# EAGLE schematic base (EAGLE 7.7.0)

## Sheet 1 of 2
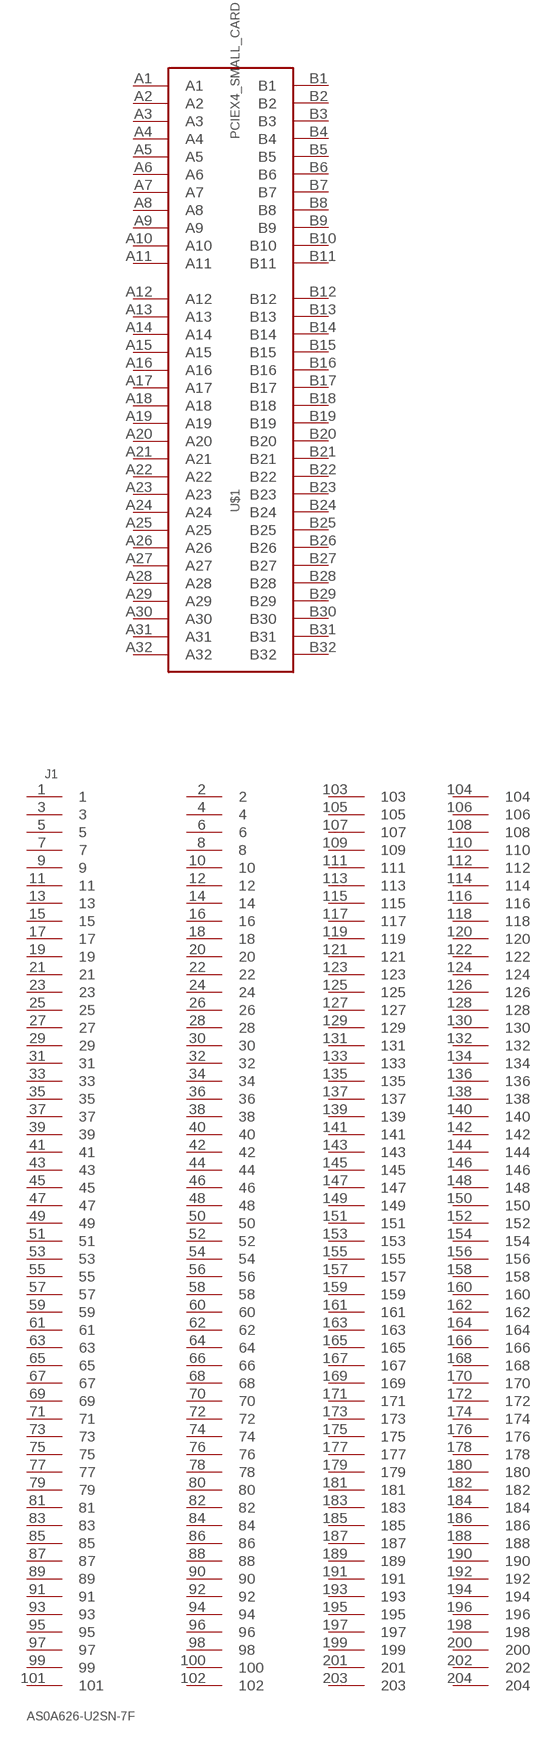
[diagram p0: schematic, sheet 1]

### Parts
J1  AS0A626-U2SN-7F  [FOXCONN_AS0A626-U2SN-7F]
U$1  PCIEX4_SMALL_CARD  [PCIEX4_SMALL_CARD]
Unconnected: J1.1 J1.2 J1.3 J1.4 J1.5 J1.6 J1.7 J1.8 J1.9 J1.10 J1.11 J1.12 J1.13 J1.14 J1.15 J1.16 J1.17 J1.18 J1.19 J1.20 J1.21 J1.22 J1.23 J1.24 J1.25 J1.26 J1.27 J1.28 J1.29 J1.30 J1.31 J1.32 J1.33 J1.34 J1.35 J1.36 J1.37 J1.38 J1.39 J1.40 J1.41 J1.42 J1.43 J1.44 J1.45 J1.46 J1.47 J1.48 J1.49 J1.50 J1.51 J1.52 J1.53 J1.54 J1.55 J1.56 J1.57 J1.58 J1.59 J1.60 J1.61 J1.62 J1.63 J1.64 J1.65 J1.66 J1.67 J1.68 J1.69 J1.70 J1.71 J1.72 J1.73 J1.74 J1.75 J1.76 J1.77 J1.78 J1.79 J1.80 J1.81 J1.82 J1.83 J1.84 J1.85 J1.86 J1.87 J1.88 J1.89 J1.90 J1.91 J1.92 J1.93 J1.94 J1.95 J1.96 J1.97 J1.98 J1.99 J1.100 J1.101 J1.102 J1.103 J1.104 J1.105 J1.106 J1.107 J1.108 J1.109 J1.110 J1.111 J1.112 J1.113 J1.114 J1.115 J1.116 J1.117 J1.118 J1.119 J1.120 J1.121 J1.122 J1.123 J1.124 J1.125 J1.126 J1.127 J1.128 J1.129 J1.130 J1.131 J1.132 J1.133 J1.134 J1.135 J1.136 J1.137 J1.138 J1.139 J1.140 J1.141 J1.142 J1.143 J1.144 J1.145 J1.146 J1.147 J1.148 J1.149 J1.150 J1.151 J1.152 J1.153 J1.154 J1.155 J1.156 J1.157 J1.158 J1.159 J1.160 J1.161 J1.162 J1.163 J1.164 J1.165 J1.166 J1.167 J1.168 J1.169 J1.170 J1.171 J1.172 J1.173 J1.174 J1.175 J1.176 J1.177 J1.178 J1.179 J1.180 J1.181 J1.182 J1.183 J1.184 J1.185 J1.186 J1.187 J1.188 J1.189 J1.190 J1.191 J1.192 J1.193 J1.194 J1.195 J1.196 J1.197 J1.198 J1.199 J1.200 J1.201 J1.202 J1.203 J1.204 U$1.A1 U$1.A2 U$1.A3 U$1.A4 U$1.A5 U$1.A6 U$1.A7 U$1.A8 U$1.A9 U$1.A10 U$1.A11 U$1.A12 U$1.A13 U$1.A14 U$1.A15 U$1.A16 U$1.A17 U$1.A18 U$1.A19 U$1.A20 U$1.A21 U$1.A22 U$1.A23 U$1.A24 U$1.A25 U$1.A26 U$1.A27 U$1.A28 U$1.A29 U$1.A30 U$1.A31 U$1.A32 U$1.B1 U$1.B2 U$1.B3 U$1.B4 U$1.B5 U$1.B6 U$1.B7 U$1.B8 U$1.B9 U$1.B10 U$1.B11 U$1.B12 U$1.B13 U$1.B14 U$1.B15 U$1.B16 U$1.B17 U$1.B18 U$1.B19 U$1.B20 U$1.B21 U$1.B22 U$1.B23 U$1.B24 U$1.B25 U$1.B26 U$1.B27 U$1.B28 U$1.B29 U$1.B30 U$1.B31 U$1.B32

## Sheet 2 of 2
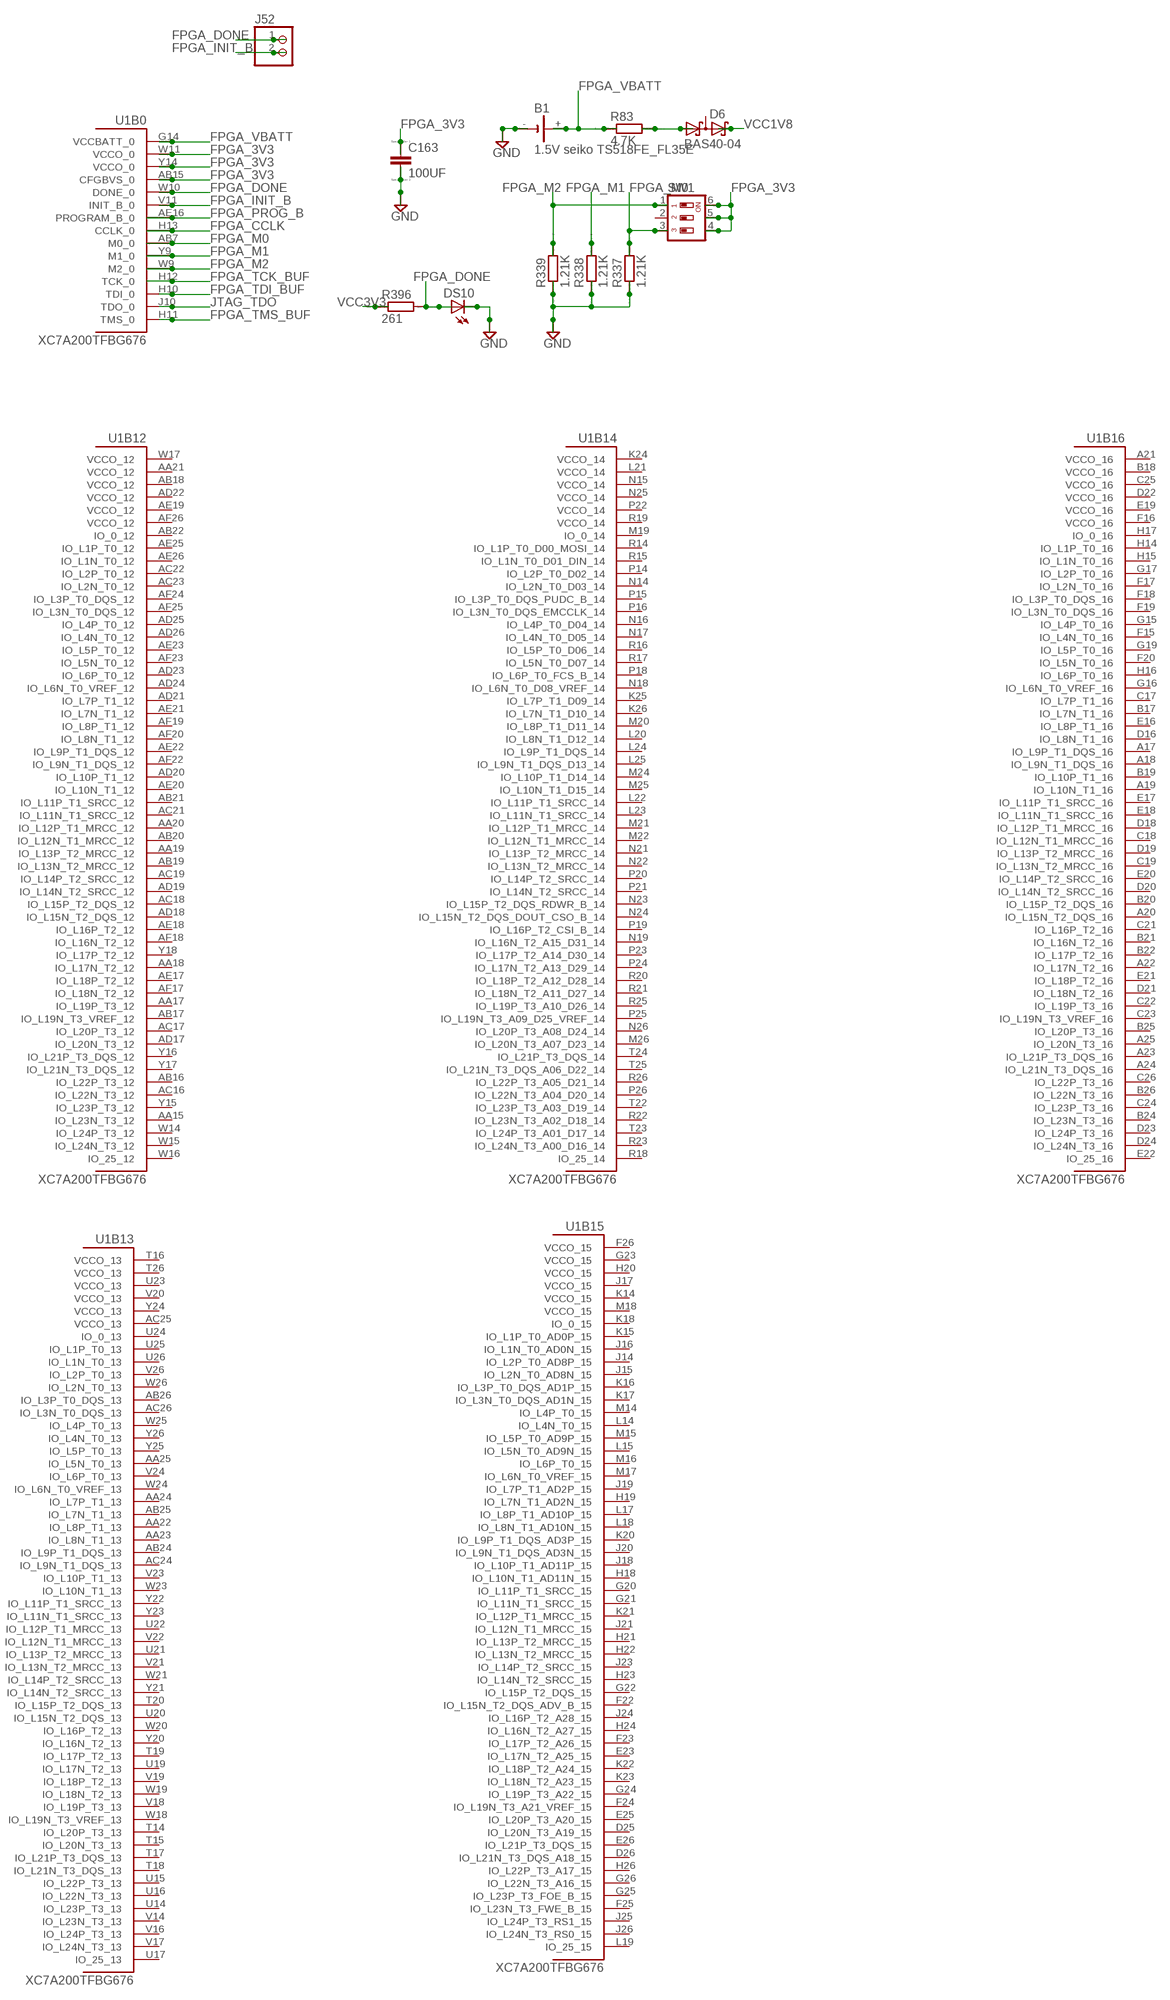
[diagram p1: schematic, sheet 2, part 1 of 3]
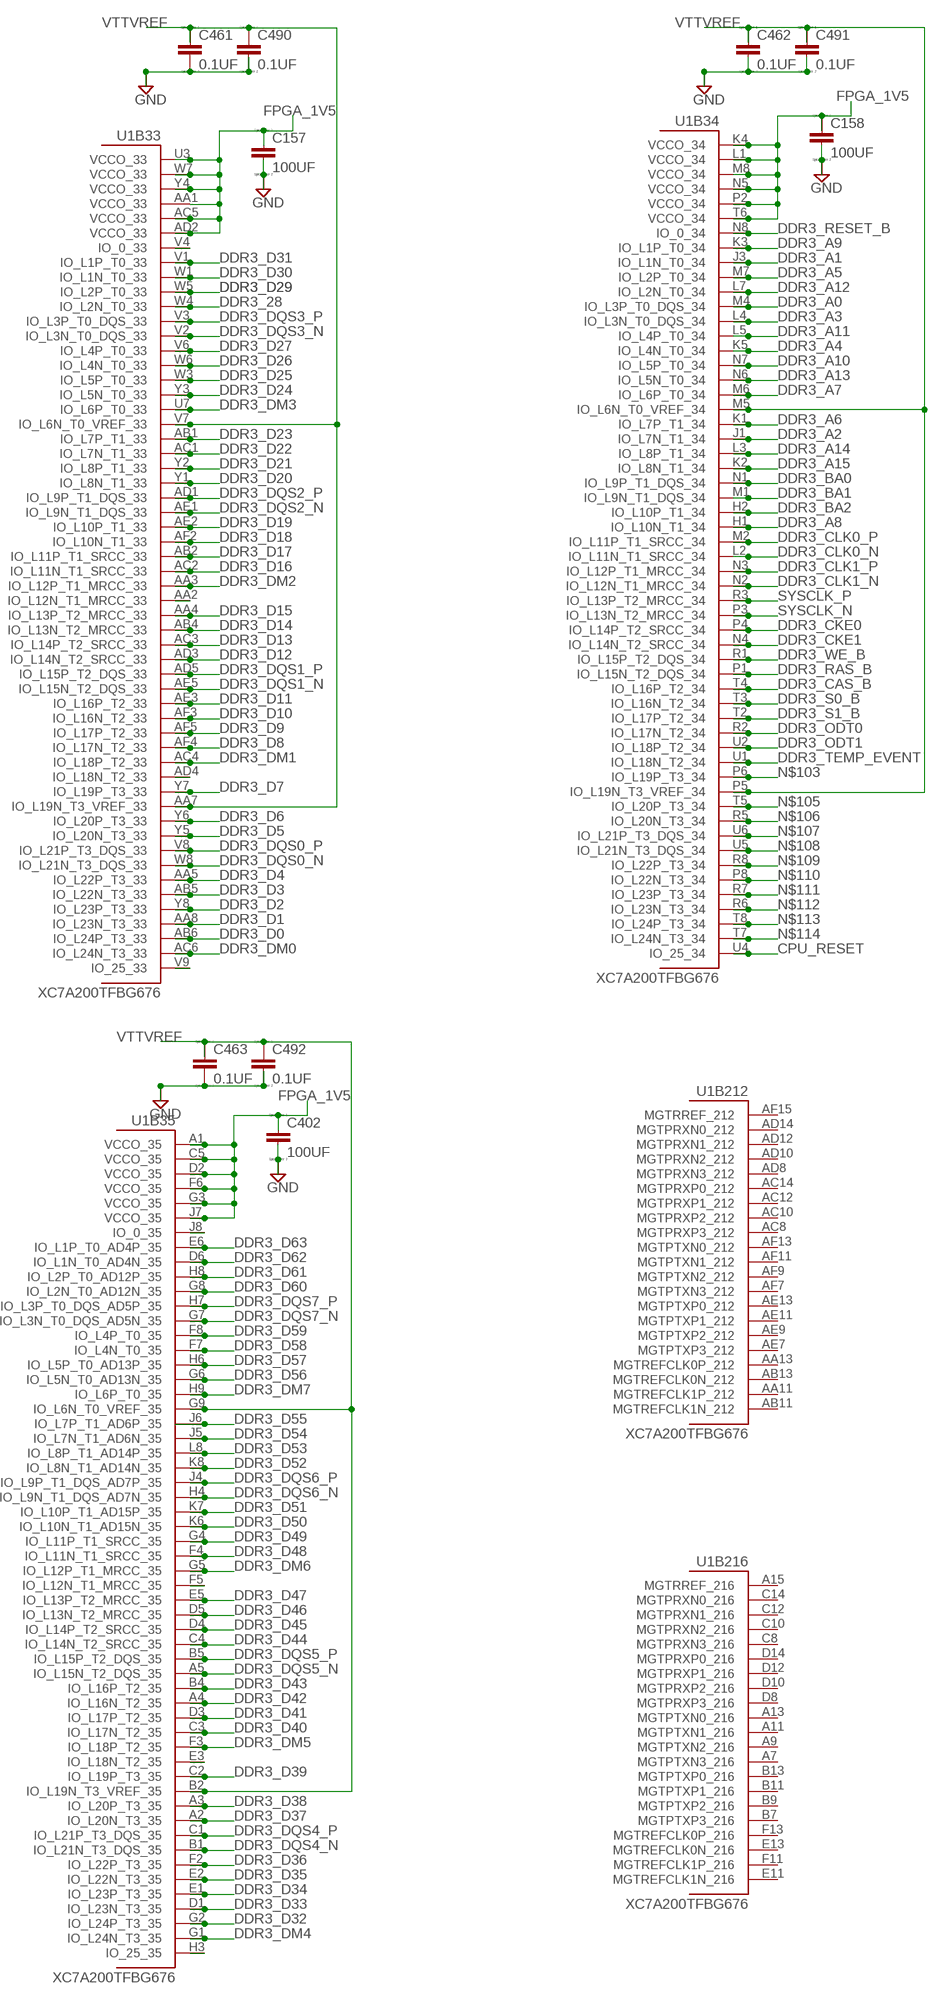
[diagram p2: schematic, sheet 2, part 2 of 3]
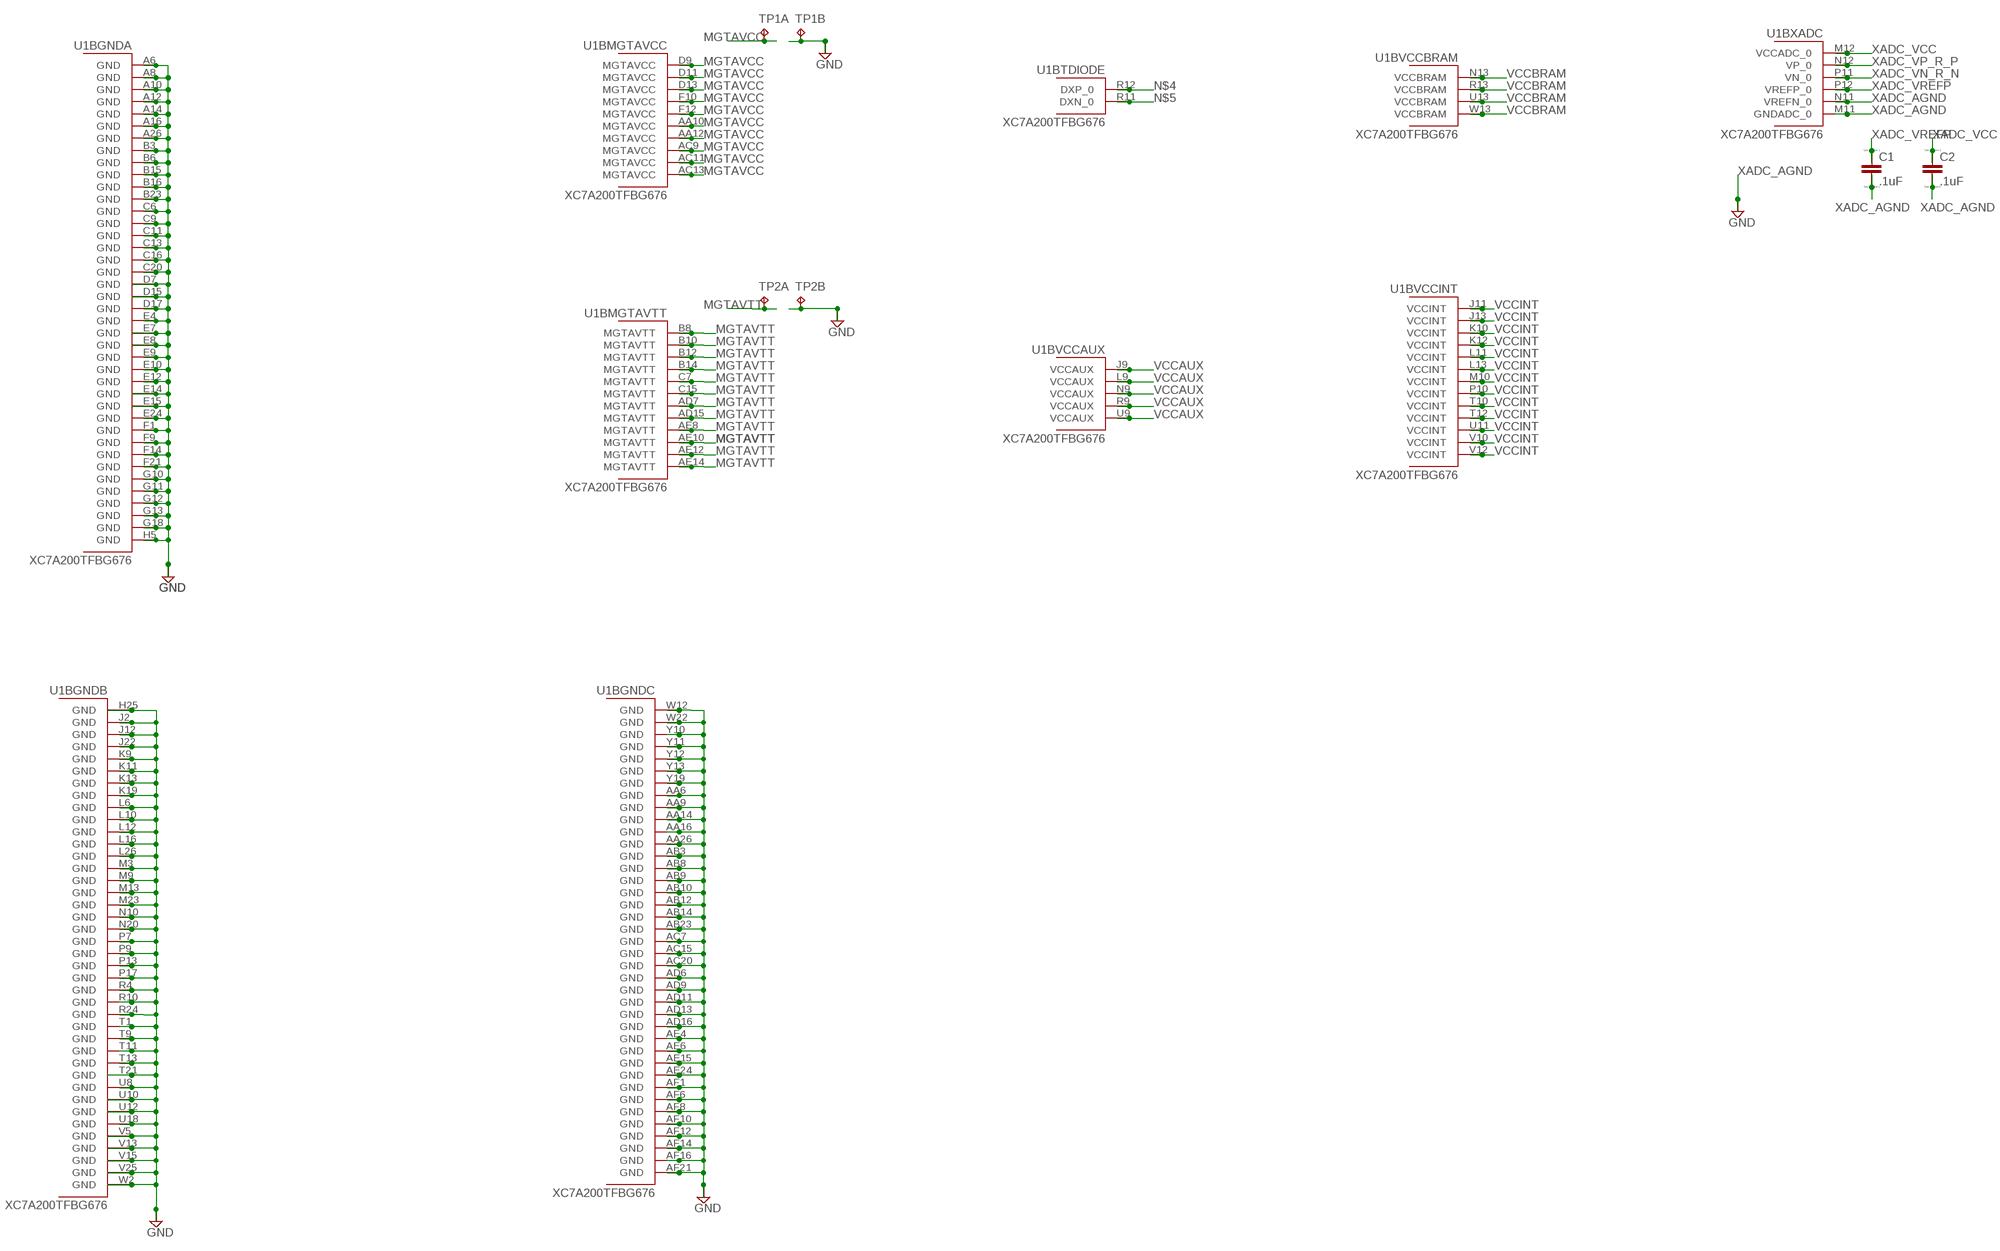
[diagram p3: schematic, sheet 2, part 3 of 3]

### Parts
B1  1.5V seiko TS518FE_FL35E  CH291-1220LF  [CH291-1220LF]
C1  .1uF  CC0402  [C0402]
C2  .1uF  CC0402  [C0402]
C157  100UF  CC1206  [C1206]
C158  100UF  CC1206  [C1206]
C163  100UF  CC1206  [C1206]
C402  100UF  CC1206  [C1206]
C461  0.1UF  CC0402  [C0402]
C462  0.1UF  CC0402  [C0402]
C463  0.1UF  CC0402  [C0402]
C490  0.1UF  CC0402  [C0402]
C491  0.1UF  CC0402  [C0402]
C492  0.1UF  CC0402  [C0402]
D6  BAS40-04  [SOT23]
DS10  LEDCHIP-LED0603  [CHIP-LED0603]
J52  PINHD-1X2  [1X02]
R83  4.7K  RR0402  [R0402]
R337  1.21K  RR0402  [R0402]
R338  1.21K  RR0402  [R0402]
R339  1.21K  RR0402  [R0402]
R396  261  RR0402  [R0402]
SW1  SWS003  [SMS-003]
TP1  TP2P2-38-17  [P2-38-17]
TP2  TP2P2-38-17  [P2-38-17]
U1  XC7A200TFBG676  [FF676]

### Nets
CPU_RESET: U1.U4(B34:IO_25_34)
DDR3_28: U1.W4(B33:IO_L2N_T0_33)
DDR3_A0: U1.M4(B34:IO_L3P_T0_DQS_34)
DDR3_A1: U1.J3(B34:IO_L1N_T0_34)
DDR3_A2: U1.J1(B34:IO_L7N_T1_34)
DDR3_A3: U1.L4(B34:IO_L3N_T0_DQS_34)
DDR3_A4: U1.K5(B34:IO_L4N_T0_34)
DDR3_A5: U1.M7(B34:IO_L2P_T0_34)
DDR3_A6: U1.K1(B34:IO_L7P_T1_34)
DDR3_A7: U1.M6(B34:IO_L6P_T0_34)
DDR3_A8: U1.H1(B34:IO_L10N_T1_34)
DDR3_A9: U1.K3(B34:IO_L1P_T0_34)
DDR3_A10: U1.N7(B34:IO_L5P_T0_34)
DDR3_A11: U1.L5(B34:IO_L4P_T0_34)
DDR3_A12: U1.L7(B34:IO_L2N_T0_34)
DDR3_A13: U1.N6(B34:IO_L5N_T0_34)
DDR3_A14: U1.L3(B34:IO_L8P_T1_34)
DDR3_A15: U1.K2(B34:IO_L8N_T1_34)
DDR3_BA0: U1.N1(B34:IO_L9P_T1_DQS_34)
DDR3_BA1: U1.M1(B34:IO_L9N_T1_DQS_34)
DDR3_BA2: U1.H2(B34:IO_L10P_T1_34)
DDR3_CAS_B: U1.T4(B34:IO_L16P_T2_34)
DDR3_CKE0: U1.P4(B34:IO_L14P_T2_SRCC_34)
DDR3_CKE1: U1.N4(B34:IO_L14N_T2_SRCC_34)
DDR3_CLK0_N: U1.L2(B34:IO_L11N_T1_SRCC_34)
DDR3_CLK0_P: U1.M2(B34:IO_L11P_T1_SRCC_34)
DDR3_CLK1_N: U1.N2(B34:IO_L12N_T1_MRCC_34)
DDR3_CLK1_P: U1.N3(B34:IO_L12P_T1_MRCC_34)
DDR3_D0: U1.AB6(B33:IO_L24P_T3_33)
DDR3_D1: U1.AA8(B33:IO_L23N_T3_33)
DDR3_D2: U1.Y8(B33:IO_L23P_T3_33)
DDR3_D3: U1.AB5(B33:IO_L22N_T3_33)
DDR3_D4: U1.AA5(B33:IO_L22P_T3_33)
DDR3_D5: U1.Y5(B33:IO_L20N_T3_33)
DDR3_D6: U1.Y6(B33:IO_L20P_T3_33)
DDR3_D7: U1.Y7(B33:IO_L19P_T3_33)
DDR3_D8: U1.AF4(B33:IO_L17N_T2_33)
DDR3_D9: U1.AF5(B33:IO_L17P_T2_33)
DDR3_D10: U1.AF3(B33:IO_L16N_T2_33)
DDR3_D11: U1.AE3(B33:IO_L16P_T2_33)
DDR3_D12: U1.AD3(B33:IO_L14N_T2_SRCC_33)
DDR3_D13: U1.AC3(B33:IO_L14P_T2_SRCC_33)
DDR3_D14: U1.AB4(B33:IO_L13N_T2_MRCC_33)
DDR3_D15: U1.AA4(B33:IO_L13P_T2_MRCC_33)
DDR3_D16: U1.AC2(B33:IO_L11N_T1_SRCC_33)
DDR3_D17: U1.AB2(B33:IO_L11P_T1_SRCC_33)
DDR3_D18: U1.AF2(B33:IO_L10N_T1_33)
DDR3_D19: U1.AE2(B33:IO_L10P_T1_33)
DDR3_D20: U1.Y1(B33:IO_L8N_T1_33)
DDR3_D21: U1.Y2(B33:IO_L8P_T1_33)
DDR3_D22: U1.AC1(B33:IO_L7N_T1_33)
DDR3_D23: U1.AB1(B33:IO_L7P_T1_33)
DDR3_D24: U1.Y3(B33:IO_L5N_T0_33)
DDR3_D25: U1.W3(B33:IO_L5P_T0_33)
DDR3_D26: U1.W6(B33:IO_L4N_T0_33)
DDR3_D27: U1.V6(B33:IO_L4P_T0_33)
DDR3_D29: U1.W5(B33:IO_L2P_T0_33)
DDR3_D30: U1.W1(B33:IO_L1N_T0_33)
DDR3_D31: U1.V1(B33:IO_L1P_T0_33)
DDR3_D32: U1.G2(B35:IO_L24P_T3_35)
DDR3_D33: U1.D1(B35:IO_L23N_T3_35)
DDR3_D34: U1.E1(B35:IO_L23P_T3_35)
DDR3_D35: U1.E2(B35:IO_L22N_T3_35)
DDR3_D36: U1.F2(B35:IO_L22P_T3_35)
DDR3_D37: U1.A2(B35:IO_L20N_T3_35)
DDR3_D38: U1.A3(B35:IO_L20P_T3_35)
DDR3_D39: U1.C2(B35:IO_L19P_T3_35)
DDR3_D40: U1.C3(B35:IO_L17N_T2_35)
DDR3_D41: U1.D3(B35:IO_L17P_T2_35)
DDR3_D42: U1.A4(B35:IO_L16N_T2_35)
DDR3_D43: U1.B4(B35:IO_L16P_T2_35)
DDR3_D44: U1.C4(B35:IO_L14N_T2_SRCC_35)
DDR3_D45: U1.D4(B35:IO_L14P_T2_SRCC_35)
DDR3_D46: U1.D5(B35:IO_L13N_T2_MRCC_35)
DDR3_D47: U1.E5(B35:IO_L13P_T2_MRCC_35)
DDR3_D48: U1.F4(B35:IO_L11N_T1_SRCC_35)
DDR3_D49: U1.G4(B35:IO_L11P_T1_SRCC_35)
DDR3_D50: U1.K6(B35:IO_L10N_T1_AD15N_35)
DDR3_D51: U1.K7(B35:IO_L10P_T1_AD15P_35)
DDR3_D52: U1.K8(B35:IO_L8N_T1_AD14N_35)
DDR3_D53: U1.L8(B35:IO_L8P_T1_AD14P_35)
DDR3_D54: U1.J5(B35:IO_L7N_T1_AD6N_35)
DDR3_D55: U1.J6(B35:IO_L7P_T1_AD6P_35)
DDR3_D56: U1.G6(B35:IO_L5N_T0_AD13N_35)
DDR3_D57: U1.H6(B35:IO_L5P_T0_AD13P_35)
DDR3_D58: U1.F7(B35:IO_L4N_T0_35)
DDR3_D59: U1.F8(B35:IO_L4P_T0_35)
DDR3_D60: U1.G8(B35:IO_L2N_T0_AD12N_35)
DDR3_D61: U1.H8(B35:IO_L2P_T0_AD12P_35)
DDR3_D62: U1.D6(B35:IO_L1N_T0_AD4N_35)
DDR3_D63: U1.E6(B35:IO_L1P_T0_AD4P_35)
DDR3_DM0: U1.AC6(B33:IO_L24N_T3_33)
DDR3_DM1: U1.AC4(B33:IO_L18P_T2_33)
DDR3_DM2: U1.AA3(B33:IO_L12P_T1_MRCC_33)
DDR3_DM3: U1.U7(B33:IO_L6P_T0_33)
DDR3_DM4: U1.G1(B35:IO_L24N_T3_35)
DDR3_DM5: U1.F3(B35:IO_L18P_T2_35)
DDR3_DM6: U1.G5(B35:IO_L12P_T1_MRCC_35)
DDR3_DM7: U1.H9(B35:IO_L6P_T0_35)
DDR3_DQS0_N: U1.W8(B33:IO_L21N_T3_DQS_33)
DDR3_DQS0_P: U1.V8(B33:IO_L21P_T3_DQS_33)
DDR3_DQS1_N: U1.AE5(B33:IO_L15N_T2_DQS_33)
DDR3_DQS1_P: U1.AD5(B33:IO_L15P_T2_DQS_33)
DDR3_DQS2_N: U1.AE1(B33:IO_L9N_T1_DQS_33)
DDR3_DQS2_P: U1.AD1(B33:IO_L9P_T1_DQS_33)
DDR3_DQS3_N: U1.V2(B33:IO_L3N_T0_DQS_33)
DDR3_DQS3_P: U1.V3(B33:IO_L3P_T0_DQS_33)
DDR3_DQS4_N: U1.B1(B35:IO_L21N_T3_DQS_35)
DDR3_DQS4_P: U1.C1(B35:IO_L21P_T3_DQS_35)
DDR3_DQS5_N: U1.A5(B35:IO_L15N_T2_DQS_35)
DDR3_DQS5_P: U1.B5(B35:IO_L15P_T2_DQS_35)
DDR3_DQS6_N: U1.H4(B35:IO_L9N_T1_DQS_AD7N_35)
DDR3_DQS6_P: U1.J4(B35:IO_L9P_T1_DQS_AD7P_35)
DDR3_DQS7_N: U1.G7(B35:IO_L3N_T0_DQS_AD5N_35)
DDR3_DQS7_P: U1.H7(B35:IO_L3P_T0_DQS_AD5P_35)
DDR3_ODT0: U1.R2(B34:IO_L17N_T2_34)
DDR3_ODT1: U1.U2(B34:IO_L18P_T2_34)
DDR3_RAS_B: U1.P1(B34:IO_L15N_T2_DQS_34)
DDR3_RESET_B: U1.N8(B34:IO_0_34)
DDR3_S0_B: U1.T3(B34:IO_L16N_T2_34)
DDR3_S1_B: U1.T2(B34:IO_L17P_T2_34)
DDR3_TEMP_EVENT: U1.U1(B34:IO_L18N_T2_34)
DDR3_WE_B: U1.R1(B34:IO_L15P_T2_DQS_34)
FPGA_1V5: C157.1 C158.1 C402.1 U1.AA1(B33:VCCO_33) U1.AC5(B33:VCCO_33) U1.AD2(B33:VCCO_33) U1.F6(B35:VCCO_35) U1.K4(B34:VCCO_34) U1.L1(B34:VCCO_34) U1.M8(B34:VCCO_34) U1.N5(B34:VCCO_34) U1.P2(B34:VCCO_34) U1.T6(B34:VCCO_34) U1.U3(B33:VCCO_33) U1.W7(B33:VCCO_33) U1.Y4(B33:VCCO_33)
FPGA_3V3: C163.1 SW1.4 SW1.5 SW1.6 U1.AB15(B0:CFGBVS_0) U1.W11(B0:VCCO_0) U1.Y14(B0:VCCO_0)
FPGA_CCLK: U1.H13(B0:CCLK_0)
FPGA_DONE: DS10.A J52.1 R396.2 U1.W10(B0:DONE_0)
FPGA_INIT_B: J52.2 U1.V11(B0:INIT_B_0)
FPGA_M0: R337.2 SW1.3 U1.AB7(B0:M0_0)
FPGA_M1: R338.2 U1.Y9(B0:M1_0)
FPGA_M2: R339.2 SW1.1 U1.W9(B0:M2_0)
FPGA_PROG_B: U1.AE16(B0:PROGRAM_B_0)
FPGA_TCK_BUF: U1.H12(B0:TCK_0)
FPGA_TDI_BUF: U1.H10(B0:TDI_0)
FPGA_TMS_BUF: U1.H11(B0:TMS_0)
FPGA_VBATT: B1.+ R83.1 U1.G14(B0:VCCBATT_0)
GND: B1.- C157.2 C158.2 C163.2 C402.2 C461.2 C462.2 C463.2 C490.2 C491.2 C492.2 DS10.C R337.1 R338.1 R339.1 TP1.TP-2 TP2.TP-2 U1.A6(BGNDA:GND) U1.A8(BGNDA:GND) U1.A10(BGNDA:GND) U1.A12(BGNDA:GND) U1.A14(BGNDA:GND) U1.A16(BGNDA:GND) U1.A26(BGNDA:GND) U1.AA6(BGNDC:GND) U1.AA9(BGNDC:GND) U1.AA14(BGNDC:GND) U1.AA16(BGNDC:GND) U1.AA26(BGNDC:GND) U1.AB3(BGNDC:GND) U1.AB8(BGNDC:GND) U1.AB9(BGNDC:GND) U1.AB10(BGNDC:GND) U1.AB12(BGNDC:GND) U1.AB14(BGNDC:GND) U1.AB23(BGNDC:GND) U1.AC7(BGNDC:GND) U1.AC15(BGNDC:GND) U1.AC20(BGNDC:GND) U1.AD6(BGNDC:GND) U1.AD9(BGNDC:GND) U1.AD11(BGNDC:GND) U1.AD13(BGNDC:GND) U1.AD16(BGNDC:GND) U1.AE4(BGNDC:GND) U1.AE6(BGNDC:GND) U1.AE15(BGNDC:GND) U1.AE24(BGNDC:GND) U1.AF1(BGNDC:GND) U1.AF6(BGNDC:GND) U1.AF8(BGNDC:GND) U1.AF10(BGNDC:GND) U1.AF12(BGNDC:GND) U1.AF14(BGNDC:GND) U1.AF16(BGNDC:GND) U1.AF21(BGNDC:GND) U1.B3(BGNDA:GND) U1.B6(BGNDA:GND) U1.B15(BGNDA:GND) U1.B16(BGNDA:GND) U1.B23(BGNDA:GND) U1.C6(BGNDA:GND) U1.C9(BGNDA:GND) U1.C11(BGNDA:GND) U1.C13(BGNDA:GND) U1.C16(BGNDA:GND) U1.C20(BGNDA:GND) U1.D7(BGNDA:GND) U1.D15(BGNDA:GND) U1.D17(BGNDA:GND) U1.E4(BGNDA:GND) U1.E7(BGNDA:GND) U1.E8(BGNDA:GND) U1.E9(BGNDA:GND) U1.E10(BGNDA:GND) U1.E12(BGNDA:GND) U1.E14(BGNDA:GND) U1.E15(BGNDA:GND) U1.E24(BGNDA:GND) U1.F1(BGNDA:GND) U1.F9(BGNDA:GND) U1.F14(BGNDA:GND) U1.F21(BGNDA:GND) U1.G10(BGNDA:GND) U1.G11(BGNDA:GND) U1.G12(BGNDA:GND) U1.G13(BGNDA:GND) U1.G18(BGNDA:GND) U1.H5(BGNDA:GND) U1.H25(BGNDB:GND) U1.J2(BGNDB:GND) U1.J12(BGNDB:GND) U1.J22(BGNDB:GND) U1.K9(BGNDB:GND) U1.K11(BGNDB:GND) U1.K13(BGNDB:GND) U1.K19(BGNDB:GND) U1.L6(BGNDB:GND) U1.L10(BGNDB:GND) U1.L12(BGNDB:GND) U1.L16(BGNDB:GND) U1.L26(BGNDB:GND) U1.M3(BGNDB:GND) U1.M9(BGNDB:GND) U1.M13(BGNDB:GND) U1.M23(BGNDB:GND) U1.N10(BGNDB:GND) U1.N20(BGNDB:GND) U1.P7(BGNDB:GND) U1.P9(BGNDB:GND) U1.P13(BGNDB:GND) U1.P17(BGNDB:GND) U1.R4(BGNDB:GND) U1.R10(BGNDB:GND) U1.R24(BGNDB:GND) U1.T1(BGNDB:GND) U1.T9(BGNDB:GND) U1.T11(BGNDB:GND) U1.T13(BGNDB:GND) U1.T21(BGNDB:GND) U1.U8(BGNDB:GND) U1.U10(BGNDB:GND) U1.U12(BGNDB:GND) U1.U18(BGNDB:GND) U1.V5(BGNDB:GND) U1.V13(BGNDB:GND) U1.V15(BGNDB:GND) U1.V25(BGNDB:GND) U1.W2(BGNDB:GND) U1.W12(BGNDC:GND) U1.W22(BGNDC:GND) U1.Y10(BGNDC:GND) U1.Y11(BGNDC:GND) U1.Y12(BGNDC:GND) U1.Y13(BGNDC:GND) U1.Y19(BGNDC:GND)
JTAG_TDO: U1.J10(B0:TDO_0)
MGTAVCC: TP1.TP-1 U1.AA10(BMGTAVCC:MGTAVCC) U1.AA12(BMGTAVCC:MGTAVCC) U1.AC9(BMGTAVCC:MGTAVCC) U1.AC11(BMGTAVCC:MGTAVCC) U1.AC13(BMGTAVCC:MGTAVCC) U1.D9(BMGTAVCC:MGTAVCC) U1.D11(BMGTAVCC:MGTAVCC) U1.D13(BMGTAVCC:MGTAVCC) U1.F10(BMGTAVCC:MGTAVCC) U1.F12(BMGTAVCC:MGTAVCC)
MGTAVTT: TP2.TP-1 U1.AD7(BMGTAVTT:MGTAVTT) U1.AD15(BMGTAVTT:MGTAVTT) U1.AE8(BMGTAVTT:MGTAVTT) U1.AE10(BMGTAVTT:MGTAVTT) U1.AE12(BMGTAVTT:MGTAVTT) U1.AE14(BMGTAVTT:MGTAVTT) U1.B8(BMGTAVTT:MGTAVTT) U1.B10(BMGTAVTT:MGTAVTT) U1.B12(BMGTAVTT:MGTAVTT) U1.B14(BMGTAVTT:MGTAVTT) U1.C7(BMGTAVTT:MGTAVTT) U1.C15(BMGTAVTT:MGTAVTT)
N$4: U1.R12(BTDIODE:DXP_0)
N$5: U1.R11(BTDIODE:DXN_0)
N$6: D6.1(A1) R83.2
N$10: U1.V4(B33:IO_0_33)
N$34: U1.AA2(B33:IO_L12N_T1_MRCC_33)
N$46: U1.AD4(B33:IO_L18N_T2_33)
N$59: U1.V9(B33:IO_25_33)
N$103: U1.P6(B34:IO_L19P_T3_34)
N$105: U1.T5(B34:IO_L20P_T3_34)
N$106: U1.R5(B34:IO_L20N_T3_34)
N$107: U1.U6(B34:IO_L21P_T3_DQS_34)
N$108: U1.U5(B34:IO_L21N_T3_DQS_34)
N$109: U1.R8(B34:IO_L22P_T3_34)
N$110: U1.P8(B34:IO_L22N_T3_34)
N$111: U1.R7(B34:IO_L23P_T3_34)
N$112: U1.R6(B34:IO_L23N_T3_34)
N$113: U1.T8(B34:IO_L24P_T3_34)
N$114: U1.T7(B34:IO_L24N_T3_34)
N$116: U1.A1(B35:VCCO_35)
N$117: U1.C5(B35:VCCO_35)
N$118: U1.D2(B35:VCCO_35)
N$120: U1.G3(B35:VCCO_35)
N$121: U1.J7(B35:VCCO_35)
N$122: U1.J8(B35:IO_0_35)
N$146: U1.F5(B35:IO_L12N_T1_MRCC_35)
N$158: U1.E3(B35:IO_L18N_T2_35)
N$171: U1.H3(B35:IO_25_35)
SYSCLK_N: U1.P3(B34:IO_L13N_T2_MRCC_34)
SYSCLK_P: U1.R3(B34:IO_L13P_T2_MRCC_34)
VCC1V8: D6.2(C2)
VCC3V3: R396.1
VCCAUX: U1.J9(BVCCAUX:VCCAUX) U1.L9(BVCCAUX:VCCAUX) U1.N9(BVCCAUX:VCCAUX) U1.R9(BVCCAUX:VCCAUX) U1.U9(BVCCAUX:VCCAUX)
VCCBRAM: U1.N13(BVCCBRAM:VCCBRAM) U1.R13(BVCCBRAM:VCCBRAM) U1.U13(BVCCBRAM:VCCBRAM) U1.W13(BVCCBRAM:VCCBRAM)
VCCINT: U1.J11(BVCCINT:VCCINT) U1.J13(BVCCINT:VCCINT) U1.K10(BVCCINT:VCCINT) U1.K12(BVCCINT:VCCINT) U1.L11(BVCCINT:VCCINT) U1.L13(BVCCINT:VCCINT) U1.M10(BVCCINT:VCCINT) U1.P10(BVCCINT:VCCINT) U1.T10(BVCCINT:VCCINT) U1.T12(BVCCINT:VCCINT) U1.U11(BVCCINT:VCCINT) U1.V10(BVCCINT:VCCINT) U1.V12(BVCCINT:VCCINT)
VTTVREF: C461.1 C462.1 C463.1 C490.1 C491.1 C492.1 U1.AA7(B33:IO_L19N_T3_VREF_33) U1.B2(B35:IO_L19N_T3_VREF_35) U1.G9(B35:IO_L6N_T0_VREF_35) U1.M5(B34:IO_L6N_T0_VREF_34) U1.P5(B34:IO_L19N_T3_VREF_34) U1.V7(B33:IO_L6N_T0_VREF_33)
XADC_AGND: C1.2 C2.2 U1.M11(BXADC:GNDADC_0) U1.N11(BXADC:VREFN_0) ; supply symbol labelled GND
XADC_VCC: C2.1 U1.M12(BXADC:VCCADC_0)
XADC_VN_R_N: U1.P11(BXADC:VN_0)
XADC_VP_R_P: U1.N12(BXADC:VP_0)
XADC_VREFP: C1.1 U1.P12(BXADC:VREFP_0)
Unconnected: D6.3(C1A2) SW1.2 U1.A7(B216:MGTPTXN3_216) U1.A9(B216:MGTPTXN2_216) U1.A11(B216:MGTPTXN1_216) U1.A13(B216:MGTPTXN0_216) U1.A15(B216:MGTRREF_216) U1.A17(B16:IO_L9P_T1_DQS_16) U1.A18(B16:IO_L9N_T1_DQS_16) U1.A19(B16:IO_L10N_T1_16) U1.A20(B16:IO_L15N_T2_DQS_16) U1.A21(B16:VCCO_16) U1.A22(B16:IO_L17N_T2_16) U1.A23(B16:IO_L21P_T3_DQS_16) U1.A24(B16:IO_L21N_T3_DQS_16) U1.A25(B16:IO_L20N_T3_16) U1.AA11(B212:MGTREFCLK1P_212) U1.AA13(B212:MGTREFCLK0P_212) U1.AA15(B12:IO_L23N_T3_12) U1.AA17(B12:IO_L19P_T3_12) U1.AA18(B12:IO_L17N_T2_12) U1.AA19(B12:IO_L13P_T2_MRCC_12) U1.AA20(B12:IO_L12P_T1_MRCC_12) U1.AA21(B12:VCCO_12) U1.AA22(B13:IO_L8P_T1_13) U1.AA23(B13:IO_L8N_T1_13) U1.AA24(B13:IO_L7P_T1_13) U1.AA25(B13:IO_L5N_T0_13) U1.AB11(B212:MGTREFCLK1N_212) U1.AB13(B212:MGTREFCLK0N_212) U1.AB16(B12:IO_L22P_T3_12) U1.AB17(B12:IO_L19N_T3_VREF_12) U1.AB18(B12:VCCO_12) U1.AB19(B12:IO_L13N_T2_MRCC_12) U1.AB20(B12:IO_L12N_T1_MRCC_12) U1.AB21(B12:IO_L11P_T1_SRCC_12) U1.AB22(B12:IO_0_12) U1.AB24(B13:IO_L9P_T1_DQS_13) U1.AB25(B13:IO_L7N_T1_13) U1.AB26(B13:IO_L3P_T0_DQS_13) U1.AC8(B212:MGTPRXP3_212) U1.AC10(B212:MGTPRXP2_212) U1.AC12(B212:MGTPRXP1_212) U1.AC14(B212:MGTPRXP0_212) U1.AC16(B12:IO_L22N_T3_12) U1.AC17(B12:IO_L20P_T3_12) U1.AC18(B12:IO_L15P_T2_DQS_12) U1.AC19(B12:IO_L14P_T2_SRCC_12) U1.AC21(B12:IO_L11N_T1_SRCC_12) U1.AC22(B12:IO_L2P_T0_12) U1.AC23(B12:IO_L2N_T0_12) U1.AC24(B13:IO_L9N_T1_DQS_13) U1.AC25(B13:VCCO_13) U1.AC26(B13:IO_L3N_T0_DQS_13) U1.AD8(B212:MGTPRXN3_212) U1.AD10(B212:MGTPRXN2_212) U1.AD12(B212:MGTPRXN1_212) U1.AD14(B212:MGTPRXN0_212) U1.AD17(B12:IO_L20N_T3_12) U1.AD18(B12:IO_L15N_T2_DQS_12) U1.AD19(B12:IO_L14N_T2_SRCC_12) U1.AD20(B12:IO_L10P_T1_12) U1.AD21(B12:IO_L7P_T1_12) U1.AD22(B12:VCCO_12) U1.AD23(B12:IO_L6P_T0_12) U1.AD24(B12:IO_L6N_T0_VREF_12) U1.AD25(B12:IO_L4P_T0_12) U1.AD26(B12:IO_L4N_T0_12) U1.AE7(B212:MGTPTXP3_212) U1.AE9(B212:MGTPTXP2_212) U1.AE11(B212:MGTPTXP1_212) U1.AE13(B212:MGTPTXP0_212) U1.AE17(B12:IO_L18P_T2_12) U1.AE18(B12:IO_L16P_T2_12) U1.AE19(B12:VCCO_12) U1.AE20(B12:IO_L10N_T1_12) U1.AE21(B12:IO_L7N_T1_12) U1.AE22(B12:IO_L9P_T1_DQS_12) U1.AE23(B12:IO_L5P_T0_12) U1.AE25(B12:IO_L1P_T0_12) U1.AE26(B12:IO_L1N_T0_12) U1.AF7(B212:MGTPTXN3_212) U1.AF9(B212:MGTPTXN2_212) U1.AF11(B212:MGTPTXN1_212) U1.AF13(B212:MGTPTXN0_212) U1.AF15(B212:MGTRREF_212) U1.AF17(B12:IO_L18N_T2_12) U1.AF18(B12:IO_L16N_T2_12) U1.AF19(B12:IO_L8P_T1_12) U1.AF20(B12:IO_L8N_T1_12) U1.AF22(B12:IO_L9N_T1_DQS_12) U1.AF23(B12:IO_L5N_T0_12) U1.AF24(B12:IO_L3P_T0_DQS_12) U1.AF25(B12:IO_L3N_T0_DQS_12) U1.AF26(B12:VCCO_12) U1.B7(B216:MGTPTXP3_216) U1.B9(B216:MGTPTXP2_216) U1.B11(B216:MGTPTXP1_216) U1.B13(B216:MGTPTXP0_216) U1.B17(B16:IO_L7N_T1_16) U1.B18(B16:VCCO_16) U1.B19(B16:IO_L10P_T1_16) U1.B20(B16:IO_L15P_T2_DQS_16) U1.B21(B16:IO_L16N_T2_16) U1.B22(B16:IO_L17P_T2_16) U1.B24(B16:IO_L23N_T3_16) U1.B25(B16:IO_L20P_T3_16) U1.B26(B16:IO_L22N_T3_16) U1.C8(B216:MGTPRXN3_216) U1.C10(B216:MGTPRXN2_216) U1.C12(B216:MGTPRXN1_216) U1.C14(B216:MGTPRXN0_216) U1.C17(B16:IO_L7P_T1_16) U1.C18(B16:IO_L12N_T1_MRCC_16) U1.C19(B16:IO_L13N_T2_MRCC_16) U1.C21(B16:IO_L16P_T2_16) U1.C22(B16:IO_L19P_T3_16) U1.C23(B16:IO_L19N_T3_VREF_16) U1.C24(B16:IO_L23P_T3_16) U1.C25(B16:VCCO_16) U1.C26(B16:IO_L22P_T3_16) U1.D8(B216:MGTPRXP3_216) U1.D10(B216:MGTPRXP2_216) U1.D12(B216:MGTPRXP1_216) U1.D14(B216:MGTPRXP0_216) U1.D16(B16:IO_L8N_T1_16) U1.D18(B16:IO_L12P_T1_MRCC_16) U1.D19(B16:IO_L13P_T2_MRCC_16) U1.D20(B16:IO_L14N_T2_SRCC_16) U1.D21(B16:IO_L18N_T2_16) U1.D22(B16:VCCO_16) U1.D23(B16:IO_L24P_T3_16) U1.D24(B16:IO_L24N_T3_16) U1.D25(B15:IO_L20N_T3_A19_15) U1.D26(B15:IO_L21N_T3_DQS_A18_15) U1.E11(B216:MGTREFCLK1N_216) U1.E13(B216:MGTREFCLK0N_216) U1.E16(B16:IO_L8P_T1_16) U1.E17(B16:IO_L11P_T1_SRCC_16) U1.E18(B16:IO_L11N_T1_SRCC_16) U1.E19(B16:VCCO_16) U1.E20(B16:IO_L14P_T2_SRCC_16) U1.E21(B16:IO_L18P_T2_16) U1.E22(B16:IO_25_16) U1.E23(B15:IO_L17N_T2_A25_15) U1.E25(B15:IO_L20P_T3_A20_15) U1.E26(B15:IO_L21P_T3_DQS_15) U1.F11(B216:MGTREFCLK1P_216) U1.F13(B216:MGTREFCLK0P_216) U1.F15(B16:IO_L4N_T0_16) U1.F16(B16:VCCO_16) U1.F17(B16:IO_L2N_T0_16) U1.F18(B16:IO_L3P_T0_DQS_16) U1.F19(B16:IO_L3N_T0_DQS_16) U1.F20(B16:IO_L5N_T0_16) U1.F22(B15:IO_L15N_T2_DQS_ADV_B_15) U1.F23(B15:IO_L17P_T2_A26_15) U1.F24(B15:IO_L19N_T3_A21_VREF_15) U1.F25(B15:IO_L23N_T3_FWE_B_15) U1.F26(B15:VCCO_15) U1.G15(B16:IO_L4P_T0_16) U1.G16(B16:IO_L6N_T0_VREF_16) U1.G17(B16:IO_L2P_T0_16) U1.G19(B16:IO_L5P_T0_16) U1.G20(B15:IO_L11P_T1_SRCC_15) U1.G21(B15:IO_L11N_T1_SRCC_15) U1.G22(B15:IO_L15P_T2_DQS_15) U1.G23(B15:VCCO_15) U1.G24(B15:IO_L19P_T3_A22_15) U1.G25(B15:IO_L23P_T3_FOE_B_15) U1.G26(B15:IO_L22N_T3_A16_15) U1.H14(B16:IO_L1P_T0_16) U1.H15(B16:IO_L1N_T0_16) U1.H16(B16:IO_L6P_T0_16) U1.H17(B16:IO_0_16) U1.H18(B15:IO_L10N_T1_AD11N_15) U1.H19(B15:IO_L7N_T1_AD2N_15) U1.H20(B15:VCCO_15) U1.H21(B15:IO_L13P_T2_MRCC_15) U1.H22(B15:IO_L13N_T2_MRCC_15) U1.H23(B15:IO_L14N_T2_SRCC_15) U1.H24(B15:IO_L16N_T2_A27_15) U1.H26(B15:IO_L22P_T3_A17_15) U1.J14(B15:IO_L2P_T0_AD8P_15) U1.J15(B15:IO_L2N_T0_AD8N_15) U1.J16(B15:IO_L1N_T0_AD0N_15) U1.J17(B15:VCCO_15) U1.J18(B15:IO_L10P_T1_AD11P_15) U1.J19(B15:IO_L7P_T1_AD2P_15) U1.J20(B15:IO_L9N_T1_DQS_AD3N_15) U1.J21(B15:IO_L12N_T1_MRCC_15) U1.J23(B15:IO_L14P_T2_SRCC_15) U1.J24(B15:IO_L16P_T2_A28_15) U1.J25(B15:IO_L24P_T3_RS1_15) U1.J26(B15:IO_L24N_T3_RS0_15) U1.K14(B15:VCCO_15) U1.K15(B15:IO_L1P_T0_AD0P_15) U1.K16(B15:IO_L3P_T0_DQS_AD1P_15) U1.K17(B15:IO_L3N_T0_DQS_AD1N_15) U1.K18(B15:IO_0_15) U1.K20(B15:IO_L9P_T1_DQS_AD3P_15) U1.K21(B15:IO_L12P_T1_MRCC_15) U1.K22(B15:IO_L18P_T2_A24_15) U1.K23(B15:IO_L18N_T2_A23_15) U1.K24(B14:VCCO_14) U1.K25(B14:IO_L7P_T1_D09_14) U1.K26(B14:IO_L7N_T1_D10_14) U1.L14(B15:IO_L4N_T0_15) U1.L15(B15:IO_L5N_T0_AD9N_15) U1.L17(B15:IO_L8P_T1_AD10P_15) U1.L18(B15:IO_L8N_T1_AD10N_15) U1.L19(B15:IO_25_15) U1.L20(B14:IO_L8N_T1_D12_14) U1.L21(B14:VCCO_14) U1.L22(B14:IO_L11P_T1_SRCC_14) U1.L23(B14:IO_L11N_T1_SRCC_14) U1.L24(B14:IO_L9P_T1_DQS_14) U1.L25(B14:IO_L9N_T1_DQS_D13_14) U1.M14(B15:IO_L4P_T0_15) U1.M15(B15:IO_L5P_T0_AD9P_15) U1.M16(B15:IO_L6P_T0_15) U1.M17(B15:IO_L6N_T0_VREF_15) U1.M18(B15:VCCO_15) U1.M19(B14:IO_0_14) U1.M20(B14:IO_L8P_T1_D11_14) U1.M21(B14:IO_L12P_T1_MRCC_14) U1.M22(B14:IO_L12N_T1_MRCC_14) U1.M24(B14:IO_L10P_T1_D14_14) U1.M25(B14:IO_L10N_T1_D15_14) U1.M26(B14:IO_L20N_T3_A07_D23_14) U1.N14(B14:IO_L2N_T0_D03_14) U1.N15(B14:VCCO_14) U1.N16(B14:IO_L4P_T0_D04_14) U1.N17(B14:IO_L4N_T0_D05_14) U1.N18(B14:IO_L6N_T0_D08_VREF_14) U1.N19(B14:IO_L16N_T2_A15_D31_14) U1.N21(B14:IO_L13P_T2_MRCC_14) U1.N22(B14:IO_L13N_T2_MRCC_14) U1.N23(B14:IO_L15P_T2_DQS_RDWR_B_14) U1.N24(B14:IO_L15N_T2_DQS_DOUT_CSO_B_14) U1.N25(B14:VCCO_14) U1.N26(B14:IO_L20P_T3_A08_D24_14) U1.P14(B14:IO_L2P_T0_D02_14) U1.P15(B14:IO_L3P_T0_DQS_PUDC_B_14) U1.P16(B14:IO_L3N_T0_DQS_EMCCLK_14) U1.P18(B14:IO_L6P_T0_FCS_B_14) U1.P19(B14:IO_L16P_T2_CSI_B_14) U1.P20(B14:IO_L14P_T2_SRCC_14) U1.P21(B14:IO_L14N_T2_SRCC_14) U1.P22(B14:VCCO_14) U1.P23(B14:IO_L17P_T2_A14_D30_14) U1.P24(B14:IO_L17N_T2_A13_D29_14) U1.P25(B14:IO_L19N_T3_A09_D25_VREF_14) U1.P26(B14:IO_L22N_T3_A04_D20_14) U1.R14(B14:IO_L1P_T0_D00_MOSI_14) U1.R15(B14:IO_L1N_T0_D01_DIN_14) U1.R16(B14:IO_L5P_T0_D06_14) U1.R17(B14:IO_L5N_T0_D07_14) U1.R18(B14:IO_25_14) U1.R19(B14:VCCO_14) U1.R20(B14:IO_L18P_T2_A12_D28_14) U1.R21(B14:IO_L18N_T2_A11_D27_14) U1.R22(B14:IO_L23N_T3_A02_D18_14) U1.R23(B14:IO_L24N_T3_A00_D16_14) U1.R25(B14:IO_L19P_T3_A10_D26_14) U1.R26(B14:IO_L22P_T3_A05_D21_14) U1.T14(B13:IO_L20P_T3_13) U1.T15(B13:IO_L20N_T3_13) U1.T16(B13:VCCO_13) U1.T17(B13:IO_L21P_T3_DQS_13) U1.T18(B13:IO_L21N_T3_DQS_13) U1.T19(B13:IO_L17P_T2_13) U1.T20(B13:IO_L15P_T2_DQS_13) U1.T22(B14:IO_L23P_T3_A03_D19_14) U1.T23(B14:IO_L24P_T3_A01_D17_14) U1.T24(B14:IO_L21P_T3_DQS_14) U1.T25(B14:IO_L21N_T3_DQS_A06_D22_14) U1.T26(B13:VCCO_13) U1.U14(B13:IO_L23P_T3_13) U1.U15(B13:IO_L22P_T3_13) U1.U16(B13:IO_L22N_T3_13) U1.U17(B13:IO_25_13) U1.U19(B13:IO_L17N_T2_13) U1.U20(B13:IO_L15N_T2_DQS_13) U1.U21(B13:IO_L13P_T2_MRCC_13) U1.U22(B13:IO_L12P_T1_MRCC_13) U1.U23(B13:VCCO_13) U1.U24(B13:IO_0_13) U1.U25(B13:IO_L1P_T0_13) U1.U26(B13:IO_L1N_T0_13) U1.V14(B13:IO_L23N_T3_13) U1.V16(B13:IO_L24P_T3_13) U1.V17(B13:IO_L24N_T3_13) U1.V18(B13:IO_L19P_T3_13) U1.V19(B13:IO_L18P_T2_13) U1.V20(B13:VCCO_13) U1.V21(B13:IO_L13N_T2_MRCC_13) U1.V22(B13:IO_L12N_T1_MRCC_13) U1.V23(B13:IO_L10P_T1_13) U1.V24(B13:IO_L6P_T0_13) U1.V26(B13:IO_L2P_T0_13) U1.W14(B12:IO_L24P_T3_12) U1.W15(B12:IO_L24N_T3_12) U1.W16(B12:IO_25_12) U1.W17(B12:VCCO_12) U1.W18(B13:IO_L19N_T3_VREF_13) U1.W19(B13:IO_L18N_T2_13) U1.W20(B13:IO_L16P_T2_13) U1.W21(B13:IO_L14P_T2_SRCC_13) U1.W23(B13:IO_L10N_T1_13) U1.W24(B13:IO_L6N_T0_VREF_13) U1.W25(B13:IO_L4P_T0_13) U1.W26(B13:IO_L2N_T0_13) U1.Y15(B12:IO_L23P_T3_12) U1.Y16(B12:IO_L21P_T3_DQS_12) U1.Y17(B12:IO_L21N_T3_DQS_12) U1.Y18(B12:IO_L17P_T2_12) U1.Y20(B13:IO_L16N_T2_13) U1.Y21(B13:IO_L14N_T2_SRCC_13) U1.Y22(B13:IO_L11P_T1_SRCC_13) U1.Y23(B13:IO_L11N_T1_SRCC_13) U1.Y24(B13:VCCO_13) U1.Y25(B13:IO_L5P_T0_13) U1.Y26(B13:IO_L4N_T0_13)

## Library data of the parts
B1 = battery:CH291-1220LF: Battery Holder, SMT, 12mm multicomp PART NO. CH291-1220LF Source: Data sheet <http://www.farnell.com/datasheets/1505860.pdf>
C1 C2 C157 C158 C163 C402 C461-C463 C490-C492 = eagle-ltspice:C: CAPACITOR, European symbol; SPICEMODEL: NONE; SPICEPREFIX: C
D6 = diode:BAS40-04: Silicon Schottky Diodes General-purpose diode for high-speed switching
DS10 = led:LED: LED OSRAM: - CHIPLED LG R971, LG N971, LY N971, LG Q971, LY Q971, LO R971, LY R971 LH N974, LH R974 LS Q976, LO Q976, LY Q976 LO Q996 - Hyper CHIPLED LW Q18S LB Q993, LB Q99A, LB R99A - SideLED LS A670, LO A670, LY A670, LG A670, LP A670 LB A673, LV A673, LT A673, LW A673 LH A674 LY A675 LS A676, LA A676, LO A676, LY A676, LW A676 LS A679, LY A679, LG A679 - Hyper Micro SIDELED® LS Y876, LA Y876, LO Y876, LY Y876 LT Y87S - SmartLED LW L88C, LW L88S LB L89C, LB L89S, LG L890 LS L89K, LO L89K, LY L89K LS L896, LA L896, LO L896, LY L896 - TOPLED LS T670, LO T670, LY T670, LG T670, LP T670 LSG T670, LSP T670, LSY T670, LOP T670, LYG T670 LG T671, LOG T671, LSG T671 LB T673, LV T673, LT T673, LW T673 LH T674 LS T676, LA T676, LO T676, LY T676, LB T676, LH T676, LSB T676, LW T676 LB T67C, LV T67C, LT T67C, LS T67K, LO T67K, LY T67K, LW E67C LS E67B, LA E67B, LO E67B, LY E67B, LB E67C, LV E67C, LT E67C LW T67C LS T679, LY T679, LG T679 LS T770, LO T770, LY T770, LG T770, LP T770 LB T773, LV T773, LT T773, LW T773 LH T774 LS E675, LA E675, LY E675, LS T675 LS T776, LA T776, LO T776, LY T776, LB T776 LHGB T686 LT T68C, LB T68C - Hyper Mini TOPLED® LB M676 - Mini TOPLED Santana® LG M470 LS M47K, LO M47K, LY M47K Source: http://www.osram.convergy.de LUXEON: - LUMILED® LXK2-PW12-R00, LXK2-PW12-S00, LXK2-PW14-U00, LXK2-PW14-V00 LXK2-PM12-R00, LXK2-PM12-S00, LXK2-PM14-U00 LXK2-PE12-Q00, LXK2-PE12-R00, LXK2-PE12-S00, LXK2-PE14-T00, LXK2-PE14-U00 LXK2-PB12-K00, LXK2-PB12-L00, LXK2-PB12-M00, LXK2-PB14-N00, LXK2-PB14-P00, LXK2-PB14-Q00 LXK2-PR12-L00, LXK2-PR12-M00, LXK2-PR14-Q00, LXK2-PR14-R00 LXK2-PD12-Q00, LXK2-PD12-R00, LXK2-PD12-S00 LXK2-PH12-R00, LXK2-PH12-S00 LXK2-PL12-P00, LXK2-PL12-Q00, LXK2-PL12-R00 Source: www.luxeon.com KINGBRIGHT: KA-3528ASYC Source: www.kingbright.com
J1 = AS0A626-U2SN-7F:AS0A626-U2SN-7F: Conn DDR3 SO DIMM SKT 204 POS 0.6mm; AVAILABILITY: Unavailable; DESCRIPTION: Connector; MF: Foxconn; MP: AS0A626-U2SN-7F; PACKAGE: None; PRICE: None
J52 = pinhead:PINHD-1X2: PIN HEADER
R83 R337-R339 R396 = eagle-ltspice:R: RESISTOR, European symbol; SPICEMODEL: NONE; SPICEPREFIX: R
SW1 = smd-special:SWS003: SMD Dip Switch 3 pol.
TP1 TP2 = testpad:TP2: Test pad
U1 = xilinx_devices_V6_custom_labels:XC7A200TFBG676: Xilinx FPGA: XC7A200TFBG676
U$1 = con-pcie-x4 short card:PCIEX4_SMALL_CARD